# Altium schematic sheet AVR_Programmer.SchDoc: AVR Programmer
size Tabloid; Date: 12/20/2022; Engineer: Terry D. Schevker; Revision: 2.0; SheetNumber: 1; SheetTotal: 4
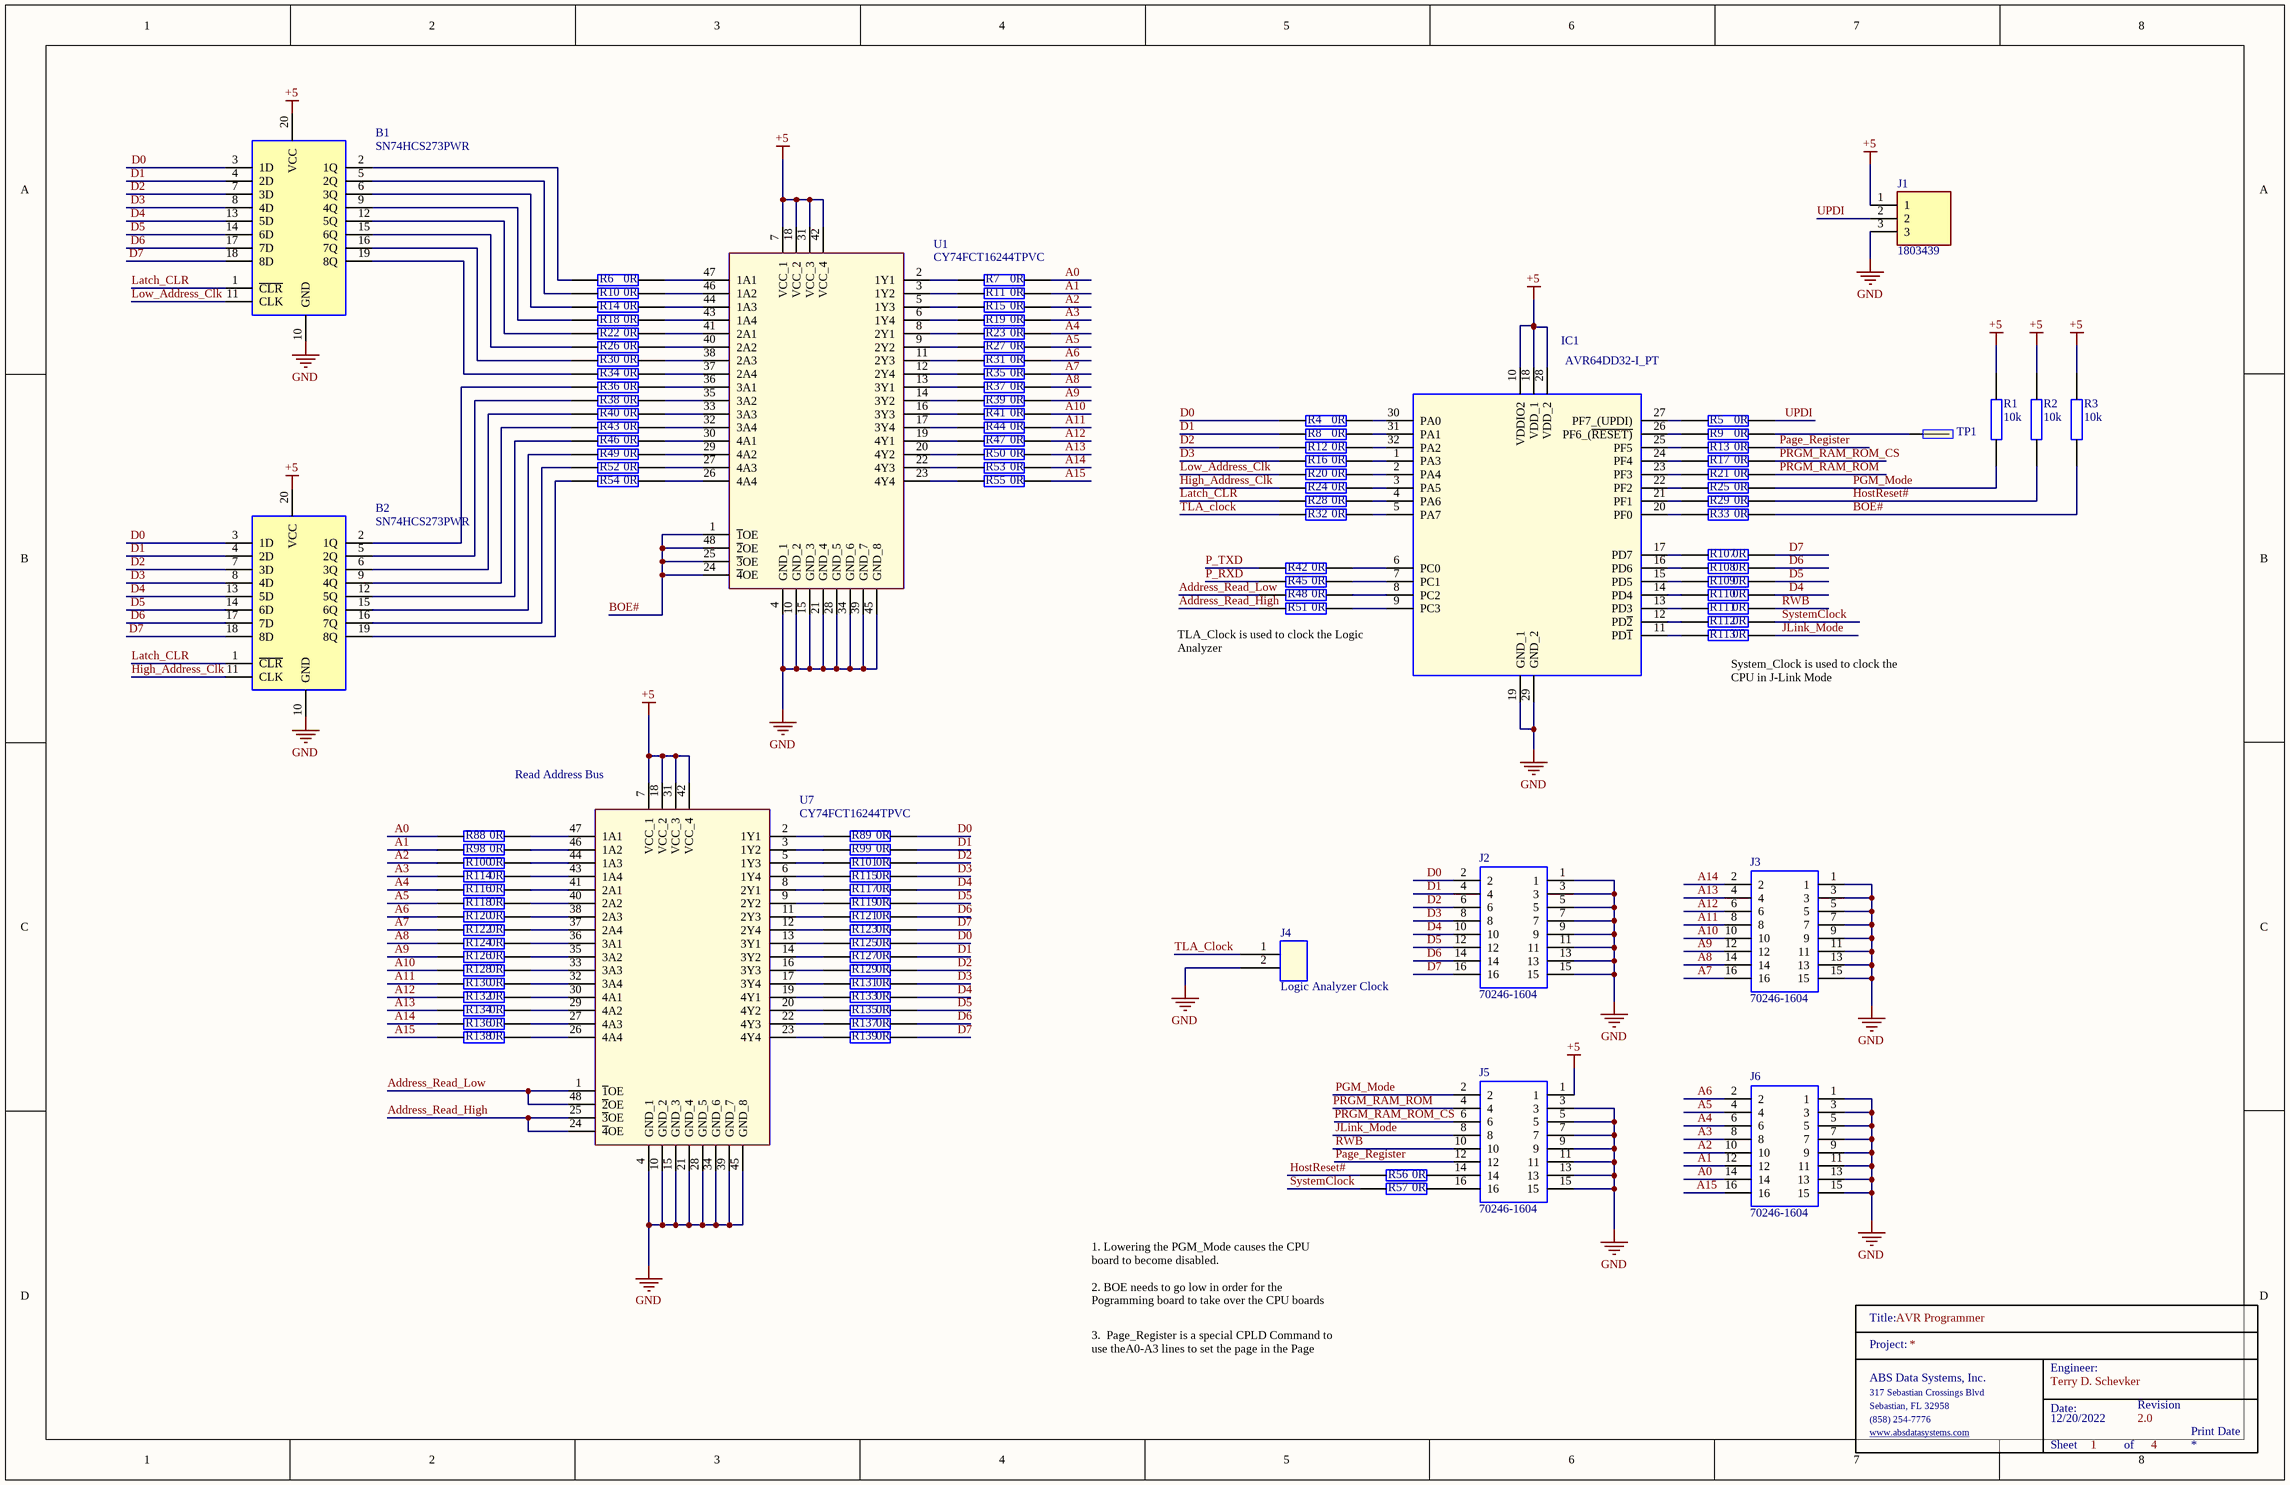
[diagram p0: AVR_Programmer.SchDoc]

## Parts
B1  SN74HCS273PWR  [SOP65P640X120-20N]
B2  SN74HCS273PWR  [SOP65P640X120-20N]
IC1  AVR64DD32-I_PT  [QFP80P900X900X120-32N]
J1  1803439  [1803439]
J2  70246-1604  [SHDR16W99P254_2X8_2794X889X927P]
J3  70246-1604  [SHDR16W99P254_2X8_2794X889X927P]
J4  Logic Analyzer Clock  [Jumper]
J5  70246-1604  [SHDR16W99P254_2X8_2794X889X927P]
J6  70246-1604  [SHDR16W99P254_2X8_2794X889X927P]
R1  10k  [0603]
R2  10k  [0603]
R3  10k  [0603]
R4  0R  [0603]
R5  0R  [0603]
R6  0R  [0603]
R7  0R  [0603]
R8  0R  [0603]
R9  0R  [0603]
R10  0R  [0603]
R11  0R  [0603]
R12  0R  [0603]
R13  0R  [0603]
R14  0R  [0603]
R15  0R  [0603]
R16  0R  [0603]
R17  0R  [0603]
R18  0R  [0603]
R19  0R  [0603]
R20  0R  [0603]
R21  0R  [0603]
R22  0R  [0603]
R23  0R  [0603]
R24  0R  [0603]
R25  0R  [0603]
R26  0R  [0603]
R27  0R  [0603]
R28  0R  [0603]
R29  0R  [0603]
R30  0R  [0603]
R31  0R  [0603]
R32  0R  [0603]
R33  0R  [0603]
R34  0R  [0603]
R35  0R  [0603]
R36  0R  [0603]
R37  0R  [0603]
R38  0R  [0603]
R39  0R  [0603]
R40  0R  [0603]
R41  0R  [0603]
R42  0R  [0603]
R43  0R  [0603]
R44  0R  [0603]
R45  0R  [0603]
R46  0R  [0603]
R47  0R  [0603]
R48  0R  [0603]
R49  0R  [0603]
R50  0R  [0603]
R51  0R  [0603]
R52  0R  [0603]
R53  0R  [0603]
R54  0R  [0603]
R55  0R  [0603]
R56  0R  [0603]
R57  0R  [0603]
R88  0R  [0603]
R89  0R  [0603]
R98  0R  [0603]
R99  0R  [0603]
R100  0R  [0603]
R101  0R  [0603]
R107  0R  [0603]
R108  0R  [0603]
R109  0R  [0603]
R110  0R  [0603]
R111  0R  [0603]
R112  0R  [0603]
R113  0R  [0603]
R114  0R  [0603]
R115  0R  [0603]
R116  0R  [0603]
R117  0R  [0603]
R118  0R  [0603]
R119  0R  [0603]
R120  0R  [0603]
R121  0R  [0603]
R122  0R  [0603]
R123  0R  [0603]
R124  0R  [0603]
R125  0R  [0603]
R126  0R  [0603]
R127  0R  [0603]
R128  0R  [0603]
R129  0R  [0603]
R130  0R  [0603]
R131  0R  [0603]
R132  0R  [0603]
R133  0R  [0603]
R134  0R  [0603]
R135  0R  [0603]
R136  0R  [0603]
R137  0R  [0603]
R138  0R  [0603]
R139  0R  [0603]
TitleBlock_2  TitleBlock  (value not drawn)  (graphical)
TP1  TP  [TP]  (value not drawn)
U1  CY74FCT16244TPVC  [SSOP-48]
U7  CY74FCT16244TPVC  [SSOP-48]

## Nets
+5: B1.20(VCC) B2.20(VCC) IC1.10(VDDIO2) IC1.18(VDD_1) IC1.28(VDD_2) J1.1 J5.1 R1.2 R2.2 R3.2 U1.7(VCC_1) U1.18(VCC_2) U1.31(VCC_3) U1.42(VCC_4) U7.7(VCC_1) U7.18(VCC_2) U7.31(VCC_3) U7.42(VCC_4)
GND: B1.10(GND) B2.10(GND) IC1.19(GND_1) IC1.29(GND_2) J1.3 J2.1 J2.3 J2.5 J2.7 J2.9 J2.11 J2.13 J2.15 J3.1 J3.3 J3.5 J3.7 J3.9 J3.11 J3.13 J3.15 J4.2 J5.3 J5.5 J5.7 J5.9 J5.11 J5.13 J5.15 J6.1 J6.3 J6.5 J6.7 J6.9 J6.11 J6.13 J6.15 U1.4(GND_1) U1.10(GND_2) U1.15(GND_3) U1.21(GND_4) U1.28(GND_5) U1.34(GND_6) U1.39(GND_7) U1.45(GND_8) U7.4(GND_1) U7.10(GND_2) U7.15(GND_3) U7.21(GND_4) U7.28(GND_5) U7.34(GND_6) U7.39(GND_7) U7.45(GND_8)
A0: J6.14 R7.2 R88.1
A1: J6.12 R11.2 R98.1
A2: J6.10 R15.2 R100.1
A3: J6.8 R19.2 R114.1
A4: J6.6 R23.2 R116.1
A5: J6.4 R27.2 R118.1
A6: J6.2 R31.2 R120.1
A7: J3.16 R35.2 R122.1
A8: J3.14 R37.2 R124.1
A9: J3.12 R39.2 R126.1
A10: J3.10 R41.2 R128.1
A11: J3.8 R44.2 R130.1
A12: J3.6 R47.2 R132.1
A13: J3.4 R50.2 R134.1
A14: J3.2 R53.2 R136.1
A15: J6.16 R55.2 R138.1
Address_Read_High: R51.1 U7.24(~{4}OE) U7.25(~{3}OE)
Address_Read_Low: R48.1 U7.1(~{1}OE) U7.48(~{2}OE)
BOE#: R3.1 R33.2 U1.1(~{1}OE) U1.24(~{4}OE) U1.25(~{3}OE) U1.48(~{2}OE)
D0: B1.3(1D) B2.3(1D) J2.2 R4.1 R89.2 R125.2
D1: B1.4(2D) B2.4(2D) J2.4 R8.1 R99.2 R127.2
D2: B1.7(3D) B2.7(3D) J2.6 R12.1 R101.2 R129.2
D3: B1.8(4D) B2.8(4D) J2.8 R16.1 R115.2 R131.2
D4: B1.13(5D) B2.13(5D) J2.10 R110.2 R117.2 R133.2
D5: B1.14(6D) B2.14(6D) J2.12 R109.2 R119.2 R135.2
D6: B1.17(7D) B2.17(7D) J2.14 R108.2 R121.2 R137.2
D7: B1.18(8D) B2.18(8D) J2.16 R107.2 R123.2 R139.2
High_Address_Clk: B2.11(CLK) R24.1
HostReset#: R2.1 R29.2 R56.1
JLink_Mode: J5.8 R113.2
Latch_CLR: B1.1(~{CLR}) B2.1(~{CLR}) R28.1
Low_Address_Clk: B1.11(CLK) R20.1
P_RXD: R45.1
P_TXD: R42.1
Page_Register: J5.12 R13.2
PGM_Mode: J5.2 R1.1 R25.2
PRGM_RAM_ROM: J5.4 R21.2
PRGM_RAM_ROM_CS: J5.6 R17.2
RWB: J5.10 R111.2
SystemClock: R57.1 R112.2
TLA_clock: J4.1 R32.1
UPDI: J1.2 R5.2
NetB1_2: B1.2(1Q) R6.1
NetB1_5: B1.5(2Q) R10.1
NetB1_6: B1.6(3Q) R14.1
NetB1_9: B1.9(4Q) R18.1
NetB1_12: B1.12(5Q) R22.1
NetB1_15: B1.15(6Q) R26.1
NetB1_16: B1.16(7Q) R30.1
NetB1_19: B1.19(8Q) R34.1
NetB2_2: B2.2(1Q) R36.1
NetB2_5: B2.5(2Q) R38.1
NetB2_6: B2.6(3Q) R40.1
NetB2_9: B2.9(4Q) R43.1
NetB2_12: B2.12(5Q) R46.1
NetB2_15: B2.15(6Q) R49.1
NetB2_16: B2.16(7Q) R52.1
NetB2_19: B2.19(8Q) R54.1
NetIC1_1: IC1.1(PA3) R16.2
NetIC1_2: IC1.2(PA4) R20.2
NetIC1_3: IC1.3(PA5) R24.2
NetIC1_4: IC1.4(PA6) R28.2
NetIC1_5: IC1.5(PA7) R32.2
NetIC1_6: IC1.6(PC0) R42.2
NetIC1_7: IC1.7(PC1) R45.2
NetIC1_8: IC1.8(PC2) R48.2
NetIC1_9: IC1.9(PC3) R51.2
NetIC1_11: IC1.11(PD~{1}) R113.1
NetIC1_12: IC1.12(PD~{2}) R112.1
NetIC1_13: IC1.13(PD3) R111.1
NetIC1_14: IC1.14(PD4) R110.1
NetIC1_15: IC1.15(PD5) R109.1
NetIC1_16: IC1.16(PD6) R108.1
NetIC1_17: IC1.17(PD7) R107.1
NetIC1_20: IC1.20(PF0) R33.1
NetIC1_21: IC1.21(PF1) R29.1
NetIC1_22: IC1.22(PF2) R25.1
NetIC1_23: IC1.23(PF3) R21.1
NetIC1_24: IC1.24(PF4) R17.1
NetIC1_25: IC1.25(PF5) R13.1
NetIC1_26: IC1.26(PF6_(~{RESET)}) R9.1
NetIC1_27: IC1.27(PF7_(UPDI)) R5.1
NetIC1_30: IC1.30(PA0) R4.2
NetIC1_31: IC1.31(PA1) R8.2
NetIC1_32: IC1.32(PA2) R12.2
NetJ5_14: J5.14 R56.2
NetJ5_16: J5.16 R57.2
NetR6_2: R6.2 U1.47(1A1)
NetR7_1: R7.1 U1.2(1Y1)
NetR9_2: R9.2 TP1.1
NetR10_2: R10.2 U1.46(1A2)
NetR11_1: R11.1 U1.3(1Y2)
NetR14_2: R14.2 U1.44(1A3)
NetR15_1: R15.1 U1.5(1Y3)
NetR18_2: R18.2 U1.43(1A4)
NetR19_1: R19.1 U1.6(1Y4)
NetR22_2: R22.2 U1.41(2A1)
NetR23_1: R23.1 U1.8(2Y1)
NetR26_2: R26.2 U1.40(2A2)
NetR27_1: R27.1 U1.9(2Y2)
NetR30_2: R30.2 U1.38(2A3)
NetR31_1: R31.1 U1.11(2Y3)
NetR34_2: R34.2 U1.37(2A4)
NetR35_1: R35.1 U1.12(2Y4)
NetR36_2: R36.2 U1.36(3A1)
NetR37_1: R37.1 U1.13(3Y1)
NetR38_2: R38.2 U1.35(3A2)
NetR39_1: R39.1 U1.14(3Y2)
NetR40_2: R40.2 U1.33(3A3)
NetR41_1: R41.1 U1.16(3Y3)
NetR43_2: R43.2 U1.32(3A4)
NetR44_1: R44.1 U1.17(3Y4)
NetR46_2: R46.2 U1.30(4A1)
NetR47_1: R47.1 U1.19(4Y1)
NetR49_2: R49.2 U1.29(4A2)
NetR50_1: R50.1 U1.20(4Y2)
NetR52_2: R52.2 U1.27(4A3)
NetR53_1: R53.1 U1.22(4Y3)
NetR54_2: R54.2 U1.26(4A4)
NetR55_1: R55.1 U1.23(4Y4)
NetR88_2: R88.2 U7.47(1A1)
NetR89_1: R89.1 U7.2(1Y1)
NetR98_2: R98.2 U7.46(1A2)
NetR99_1: R99.1 U7.3(1Y2)
NetR100_2: R100.2 U7.44(1A3)
NetR101_1: R101.1 U7.5(1Y3)
NetR114_2: R114.2 U7.43(1A4)
NetR115_1: R115.1 U7.6(1Y4)
NetR116_2: R116.2 U7.41(2A1)
NetR117_1: R117.1 U7.8(2Y1)
NetR118_2: R118.2 U7.40(2A2)
NetR119_1: R119.1 U7.9(2Y2)
NetR120_2: R120.2 U7.38(2A3)
NetR121_1: R121.1 U7.11(2Y3)
NetR122_2: R122.2 U7.37(2A4)
NetR123_1: R123.1 U7.12(2Y4)
NetR124_2: R124.2 U7.36(3A1)
NetR125_1: R125.1 U7.13(3Y1)
NetR126_2: R126.2 U7.35(3A2)
NetR127_1: R127.1 U7.14(3Y2)
NetR128_2: R128.2 U7.33(3A3)
NetR129_1: R129.1 U7.16(3Y3)
NetR130_2: R130.2 U7.32(3A4)
NetR131_1: R131.1 U7.17(3Y4)
NetR132_2: R132.2 U7.30(4A1)
NetR133_1: R133.1 U7.19(4Y1)
NetR134_2: R134.2 U7.29(4A2)
NetR135_1: R135.1 U7.20(4Y2)
NetR136_2: R136.2 U7.27(4A3)
NetR137_1: R137.1 U7.22(4Y3)
NetR138_2: R138.2 U7.26(4A4)
NetR139_1: R139.1 U7.23(4Y4)

## Notes on the sheet
- (near R51) TLA_Clock is used to clock the Logic Analyzer
- System_Clock is used to clock the CPU in J-Link Mode
- (near U7) Read Address Bus
- 1. Lowering the PGM_Mode causes the CPU board to become disabled.
- 2. BOE needs to go low in order for the Pogramming board to take over the CPU boards Bus
- 3.  Page_Register is a special CPLD Command to use theA0-A3 lines to set the page in the Page Register.
- Print Date
- (in symbol TitleBlock) Title:; Project:; Engineer:; ABS Data Systems, Inc.; 317 Sebastian Crossings Blvd; Sebastian, FL 32958; Date:; Revision; (858) 254-7776; www.absdatasystems.com; Sheet; of

## Library data of the parts
B1 B2 = SN74HCS273PWR: Flip Flops Octal D-type flip-flops with clear with Schmitt-trigger inputs; Manufacturer_Name: Texas Instruments; Geometry.Height: 1.2mm; Mouser Part Number: 595-SN74HCS273PWR; Mouser Price/Stock: https://www.mouser.co.uk/ProductDetail/Texas-Instruments/SN74HCS273PWR?qs=QNEnbhJQKvYIJo9rBWLKyw%3D%3D; Manufacturer_Part_Number: SN74HCS273PWR; Datasheet Link: https://www.ti.com/general/docs/suppproductinfo.tsp?distId=26&gotoUrl=https://www.ti.com/lit/gpn/sn74hcs273
IC1 = AVR64DD32-I_PT: Integrated Circuit; Manufacturer_Name: Microchip; Manufacturer_Part_Number: AVR64DD32-I/PT | MULTI-VOLTAGE I/O; Datasheet Link: https://www.microchip.com/en-us/product/AVR64DD32; Height: 1.2mm
J1 = 1803439: Connector; Manufacturer_Name: Phoenix Contact; Datasheet Link: http://uk.rs-online.com/web/p/products/2204838; Manufacturer_Part_Number: 1803439; Mouser Part Number: 651-1803439; Mouser Price/Stock: https://www.mouser.co.uk/ProductDetail/Phoenix-Contact/1803439?qs=ChwaSN6Xm4%2FKqu7eZUAe4w%3D%3D; Arrow Part Number: 1803439; Arrow Price/Stock: https://www.arrow.com/en/products/1803439/phoenix-contact?region=nac
J2 J3 J5 J6 = 70246-1604: Molex C-GRID 70246, 2.54mm Pitch, 16 Way, 2 Row, Straight PCB Header, Through Hole; Geometry.Height: 9.27mm; Mouser Part Number: 538-70246-1604; Mouser Price/Stock: https://www.mouser.co.uk/ProductDetail/Molex/70246-1604?qs=KUIzHt%2Fe91njhb67Cjmalw%3D%3D; Manufacturer_Name: Molex; Manufacturer_Part_Number: 70246-1604; Datasheet Link: https://www.molex.com/pdm_docs/sd/702461604_sd.pdf
J4 = Jumper: 16 Pin 3x8 Through Hold Jumprts; Manufacturer: Samtec; Manufacturer Part Number: TST-108-01-G-D; Number of Contacts: 16; Gender: Male; Connector Type: Male Pin; Pitch: 2.54mm; Row Spacing: 0.1inch; Supplier 1: Digi-Key; RoHS: Yes; Category: Headers and Wire Housings; Stock 1: 227; Pricing 1: 1=2.85000, 10=2.73600, 100=2.28000, 500=1.93800, 1000=1.65300, 5000=1.48200 (USD); Mount: Through Hole; Contact Plating: Gold; Contact Material: Bronze; Housing Material: Polyester; Housing Color: Black; Color: Black; Min Operating Temperature: -55°C; Max Operating Temperature: 125°C; Number of Rows: 2; Termination: Solder; Packaging: Rail/Tube; Orientation: Straight; Number of Positions: 16; Length: 27.94mm; Depth: 9.27mm; Contact Mating Length: 0.25inch; REACH SVHC: No SVHC; ComponentLink1URL: https://datasheet.ciiva.com/739/tst-mkt-739845.pdf?src-supplier=Digi-Key; ComponentLink1Description: https://datasheet.ciiva.com/739/tst-mkt-739845.pdf?src-supplier=Digi-Key; ComponentLink2URL: https://datasheet.ciiva.com/10018/htst-10018510.pdf?src-supplier=Avnet; ComponentLink2Description: https://datasheet.ciiva.com/10018/htst-10018510.pdf?src-supplier=Avnet
R1-R3 = RC0603JR-0710KL: YAGEO 0603 10k ohm; Manufacturer_Name: KEMET; Manufacturer_Part_Number: RC0603JR-070RL; Geometry.Height: 0.55mm; Mouser Part Number: 603-RC0603JR-070RL; Mouser Price/Stock: https://www.mouser.co.uk/ProductDetail/YAGEO/RC0603JR-070RL?qs=2cAdsCoAWRGWyPcuXgGiXQ%3D%3D; Datasheet Link: https://datasheet.datasheetarchive.com/originals/distributors/Datasheets_SAMA/902f9e387b938f871d31120f5fc1d65e.pdf
R4-R57 R88 R89 R98-R101 R107-R139 = RC0603JR-070RL: YAGEO 0603 0 ohm; Manufacturer_Name: KEMET; Geometry.Height: 0.55mm; Mouser Part Number: 603-RC0603JR-070RL; Mouser Price/Stock: https://www.mouser.co.uk/ProductDetail/YAGEO/RC0603JR-070RL?qs=2cAdsCoAWRGWyPcuXgGiXQ%3D%3D; Manufacturer_Part_Number: RC0603JR-070RL; Datasheet Link: https://datasheet.datasheetarchive.com/originals/distributors/Datasheets_SAMA/902f9e387b938f871d31120f5fc1d65e.pdf
TP1 = TP: Manufacturer: Samtec; Manufacturer Part Number: TST-105-01-G-D; Number of Contacts: 16; Gender: Male; Connector Type: Male Pin; Pitch: 2.54mm; Row Spacing: 0.1inch; Supplier 1: Digi-Key; RoHS: Yes; Category: Headers and Wire Housings; Stock 1: 227; Pricing 1: 1=2.85000, 10=2.73600, 100=2.28000, 500=1.93800, 1000=1.65300, 5000=1.48200 (USD); Mount: Through Hole; Contact Plating: Gold; Contact Material: Bronze; Housing Material: Polyester; Housing Color: Black; Color: Black; Min Operating Temperature: -55°C; Max Operating Temperature: 125°C; Number of Rows: 2; Termination: Solder; Packaging: Rail/Tube; Orientation: Straight; Number of Positions: 16; Length: 27.94mm; Depth: 9.27mm; Contact Mating Length: 0.25inch; REACH SVHC: No SVHC; ComponentLink1URL: https://datasheet.ciiva.com/739/tst-mkt-739845.pdf?src-supplier=Digi-Key; ComponentLink1Description: https://datasheet.ciiva.com/739/tst-mkt-739845.pdf?src-supplier=Digi-Key; ComponentLink2URL: https://datasheet.ciiva.com/10018/htst-10018510.pdf?src-supplier=Avnet; ComponentLink2Description: https://datasheet.ciiva.com/10018/htst-10018510.pdf?src-supplier=Avnet
U1 U7 = CY74FCT16244TPVC: 16-Bit Buffers/Drivers with 3-State Outputs; Manufacturer_Name: Texas Instruments; Geometry.Height: 2.79mm; Mouser Part Number: 595-CY74FCT16244TPVC; Mouser Price/Stock: https://www.mouser.co.uk/ProductDetail/Texas-Instruments/CY74FCT16244TPVC?qs=vul0MlC%2Fa1eu%2FYdtT7AvpQ%3D%3D; Manufacturer_Part_Number: CY74FCT16244TPVC; Datasheet Link: http://www.ti.com/lit/gpn/CY74FCT16244T